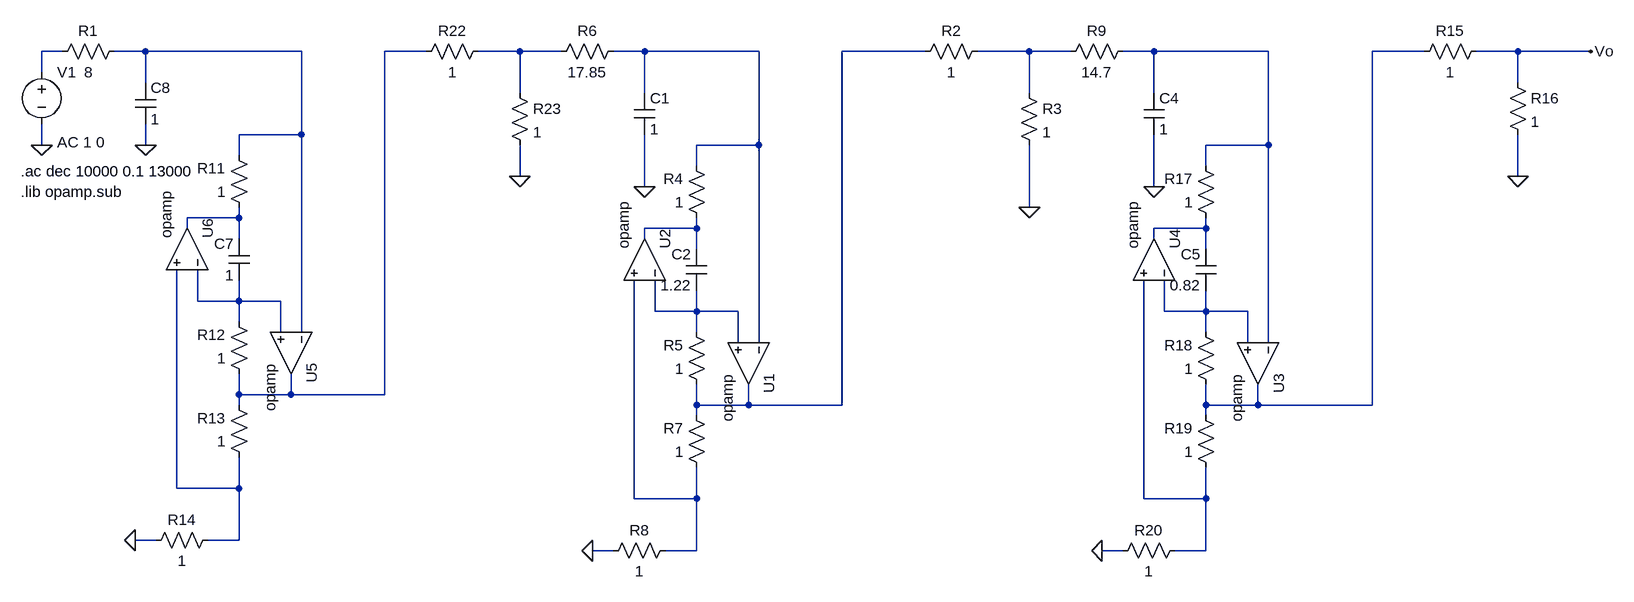
[diagram p0: schematic TS4.asc]
TS4.asc, the LTspice schematic file:
Version 4
SHEET 1 3156 896
WIRE -288 80 -320 80
WIRE -160 80 -208 80
WIRE 80 80 -160 80
WIRE 272 80 208 80
WIRE 416 80 352 80
WIRE 480 80 416 80
WIRE 608 80 560 80
WIRE 784 80 608 80
WIRE 1040 80 912 80
WIRE 1200 80 1120 80
WIRE 1264 80 1200 80
WIRE 1392 80 1344 80
WIRE 1568 80 1392 80
WIRE 1808 80 1728 80
WIRE 1952 80 1888 80
WIRE 2064 80 1952 80
WIRE -320 112 -320 80
WIRE -160 128 -160 80
WIRE 1952 128 1952 80
WIRE 416 144 416 80
WIRE 608 144 608 80
WIRE 1200 144 1200 80
WIRE 1392 144 1392 80
WIRE 80 208 80 80
WIRE 80 208 -16 208
WIRE -320 224 -320 192
WIRE -160 224 -160 192
WIRE 784 224 784 80
WIRE 784 224 688 224
WIRE 1568 224 1568 80
WIRE 1568 224 1472 224
WIRE -16 240 -16 208
WIRE 688 256 688 224
WIRE 1472 256 1472 224
WIRE 416 272 416 224
WIRE 1952 272 1952 208
WIRE 608 288 608 208
WIRE 1392 288 1392 208
WIRE 1200 320 1200 224
WIRE -16 336 -16 320
WIRE -16 336 -96 336
WIRE -96 352 -96 336
WIRE 688 352 688 336
WIRE 688 352 608 352
WIRE 1472 352 1472 336
WIRE 1472 352 1392 352
WIRE -16 368 -16 336
WIRE 608 368 608 352
WIRE 1392 368 1392 352
WIRE 688 384 688 352
WIRE 1472 384 1472 352
WIRE -80 464 -80 416
WIRE -16 464 -16 432
WIRE -16 464 -80 464
WIRE 48 464 -16 464
WIRE 624 480 624 432
WIRE 688 480 688 448
WIRE 688 480 624 480
WIRE 752 480 688 480
WIRE 1408 480 1408 432
WIRE 1472 480 1472 448
WIRE 1472 480 1408 480
WIRE 1536 480 1472 480
WIRE -16 496 -16 464
WIRE 48 512 48 464
WIRE 80 512 80 208
WIRE 688 512 688 480
WIRE 1472 512 1472 480
WIRE 752 528 752 480
WIRE 784 528 784 224
WIRE 1536 528 1536 480
WIRE 1568 528 1568 224
WIRE -16 608 -16 576
WIRE 64 608 64 576
WIRE 64 608 -16 608
WIRE 208 608 208 80
WIRE 208 608 64 608
WIRE -16 624 -16 608
WIRE 688 624 688 592
WIRE 768 624 768 592
WIRE 768 624 688 624
WIRE 912 624 912 80
WIRE 912 624 768 624
WIRE 1472 624 1472 592
WIRE 1552 624 1552 592
WIRE 1552 624 1472 624
WIRE 1728 624 1728 80
WIRE 1728 624 1552 624
WIRE 688 640 688 624
WIRE 1472 640 1472 624
WIRE -112 752 -112 416
WIRE -16 752 -16 704
WIRE -16 752 -112 752
WIRE 592 768 592 432
WIRE 688 768 688 720
WIRE 688 768 592 768
WIRE 1376 768 1376 432
WIRE 1472 768 1472 720
WIRE 1472 768 1376 768
WIRE -144 832 -176 832
WIRE -16 832 -16 752
WIRE -16 832 -64 832
WIRE 560 848 528 848
WIRE 688 848 688 768
WIRE 688 848 640 848
WIRE 1344 848 1312 848
WIRE 1472 848 1472 768
WIRE 1472 848 1424 848
FLAG -320 224 0
FLAG -176 832 0
FLAG -160 224 0
FLAG 608 288 0
FLAG 528 848 0
FLAG 1392 288 0
FLAG 1312 848 0
FLAG 416 272 0
FLAG 1200 320 0
FLAG 1952 272 0
FLAG 2064 80 Vo
SYMBOL res -192 64 R90
WINDOW 0 0 56 VBottom 2
WINDOW 3 32 56 VTop 2
SYMATTR InstName R1
SYMATTR Value 8
SYMBOL voltage -320 96 R0
WINDOW 123 24 124 Left 2
WINDOW 39 0 0 Left 0
SYMATTR Value2 AC 1 0
SYMATTR InstName V1
SYMATTR Value ""
SYMBOL res 576 64 R90
WINDOW 0 0 56 VBottom 2
WINDOW 3 32 56 VTop 2
SYMATTR InstName R6
SYMATTR Value 17.85
SYMBOL OpAmps\\opamp 128 544 R90
SYMATTR InstName U5
SYMBOL res 0 336 R180
WINDOW 0 36 76 Left 2
WINDOW 3 36 40 Left 2
SYMATTR InstName R11
SYMATTR Value 1
SYMBOL cap 0 432 R180
WINDOW 0 24 56 Left 2
WINDOW 3 24 8 Left 2
SYMATTR InstName C7
SYMATTR Value 1
SYMBOL OpAmps\\opamp -32 384 M270
SYMATTR InstName U6
SYMBOL res 0 592 R180
WINDOW 0 36 76 Left 2
WINDOW 3 36 40 Left 2
SYMATTR InstName R12
SYMATTR Value 1
SYMBOL res 0 720 R180
WINDOW 0 36 76 Left 2
WINDOW 3 36 40 Left 2
SYMATTR InstName R13
SYMATTR Value 1
SYMBOL res -48 816 R90
WINDOW 0 0 56 VBottom 2
WINDOW 3 32 56 VTop 2
SYMATTR InstName R14
SYMATTR Value 1
SYMBOL cap -176 128 R0
SYMATTR InstName C8
SYMATTR Value 1
SYMBOL cap 592 144 R0
SYMATTR InstName C1
SYMATTR Value 1
SYMBOL OpAmps\\opamp 832 560 R90
SYMATTR InstName U1
SYMBOL res 704 352 R180
WINDOW 0 36 76 Left 2
WINDOW 3 36 40 Left 2
SYMATTR InstName R4
SYMATTR Value 1
SYMBOL cap 704 448 R180
WINDOW 0 24 56 Left 2
WINDOW 3 24 8 Left 2
SYMATTR InstName C2
SYMATTR Value 1.22
SYMBOL OpAmps\\opamp 672 400 M270
SYMATTR InstName U2
SYMBOL res 704 608 R180
WINDOW 0 36 76 Left 2
WINDOW 3 36 40 Left 2
SYMATTR InstName R5
SYMATTR Value 1
SYMBOL res 704 736 R180
WINDOW 0 36 76 Left 2
WINDOW 3 36 40 Left 2
SYMATTR InstName R7
SYMATTR Value 1
SYMBOL res 656 832 R90
WINDOW 0 0 56 VBottom 2
WINDOW 3 32 56 VTop 2
SYMATTR InstName R8
SYMATTR Value 1
SYMBOL res 1360 64 R90
WINDOW 0 0 56 VBottom 2
WINDOW 3 32 56 VTop 2
SYMATTR InstName R9
SYMATTR Value 14.7
SYMBOL cap 1376 144 R0
SYMATTR InstName C4
SYMATTR Value 1
SYMBOL OpAmps\\opamp 1616 560 R90
SYMATTR InstName U3
SYMBOL res 1488 352 R180
WINDOW 0 36 76 Left 2
WINDOW 3 36 40 Left 2
SYMATTR InstName R17
SYMATTR Value 1
SYMBOL cap 1488 448 R180
WINDOW 0 24 56 Left 2
WINDOW 3 24 8 Left 2
SYMATTR InstName C5
SYMATTR Value 0.82
SYMBOL OpAmps\\opamp 1456 400 M270
SYMATTR InstName U4
SYMBOL res 1488 608 R180
WINDOW 0 36 76 Left 2
WINDOW 3 36 40 Left 2
SYMATTR InstName R18
SYMATTR Value 1
SYMBOL res 1488 736 R180
WINDOW 0 36 76 Left 2
WINDOW 3 36 40 Left 2
SYMATTR InstName R19
SYMATTR Value 1
SYMBOL res 1440 832 R90
WINDOW 0 0 56 VBottom 2
WINDOW 3 32 56 VTop 2
SYMATTR InstName R20
SYMATTR Value 1
SYMBOL res 368 64 R90
WINDOW 0 0 56 VBottom 2
WINDOW 3 32 56 VTop 2
SYMATTR InstName R22
SYMATTR Value 1
SYMBOL res 400 128 R0
SYMATTR InstName R23
SYMATTR Value 1
SYMBOL res 1136 64 R90
WINDOW 0 0 56 VBottom 2
WINDOW 3 32 56 VTop 2
SYMATTR InstName R2
SYMATTR Value 1
SYMBOL res 1184 128 R0
SYMATTR InstName R3
SYMATTR Value 1
SYMBOL res 1904 64 R90
WINDOW 0 0 56 VBottom 2
WINDOW 3 32 56 VTop 2
SYMATTR InstName R15
SYMATTR Value 1
SYMBOL res 1936 112 R0
SYMATTR InstName R16
SYMATTR Value 1
TEXT -352 264 Left 2 !.ac dec 10000 0.1 13000
TEXT -352 296 Left 2 !.lib opamp.sub

The netlist it stands for:
* TS4.asc
R1 N002 N001 8
V1 N001 0 AC 1 0
R6 N005 N004 17.85
XU5 N002 N013 N003 opamp Aol=100K GBW=10Meg  ; pins invin noninvin out
R11 N010 N002 1
C7 N013 N010 1
XU6 N013 N016 N010 opamp Aol=100K GBW=10Meg  ; pins invin noninvin out
R12 N003 N013 1
R13 N016 N003 1
R14 N016 0 1
C8 N002 0 1
C1 N005 0 1
XU1 N005 N014 N006 opamp Aol=100K GBW=10Meg  ; pins invin noninvin out
R4 N011 N005 1
C2 N014 N011 1.22
XU2 N014 N017 N011 opamp Aol=100K GBW=10Meg  ; pins invin noninvin out
R5 N006 N014 1
R7 N017 N006 1
R8 N017 0 1
R9 N008 N007 14.7
C4 N008 0 1
XU3 N008 N015 N009 opamp Aol=100K GBW=10Meg  ; pins invin noninvin out
R17 N012 N008 1
C5 N015 N012 0.82
XU4 N015 N018 N012 opamp Aol=100K GBW=10Meg  ; pins invin noninvin out
R18 N009 N015 1
R19 N018 N009 1
R20 N018 0 1
R22 N004 N003 1
R23 N004 0 1
R2 N007 N006 1
R3 N007 0 1
R15 Vo N009 1
R16 Vo 0 1
.ac dec 10000 0.1 13000
.lib opamp.sub
.backanno
.end